# EAGLE schematic ilmat (EAGLE 6.3)
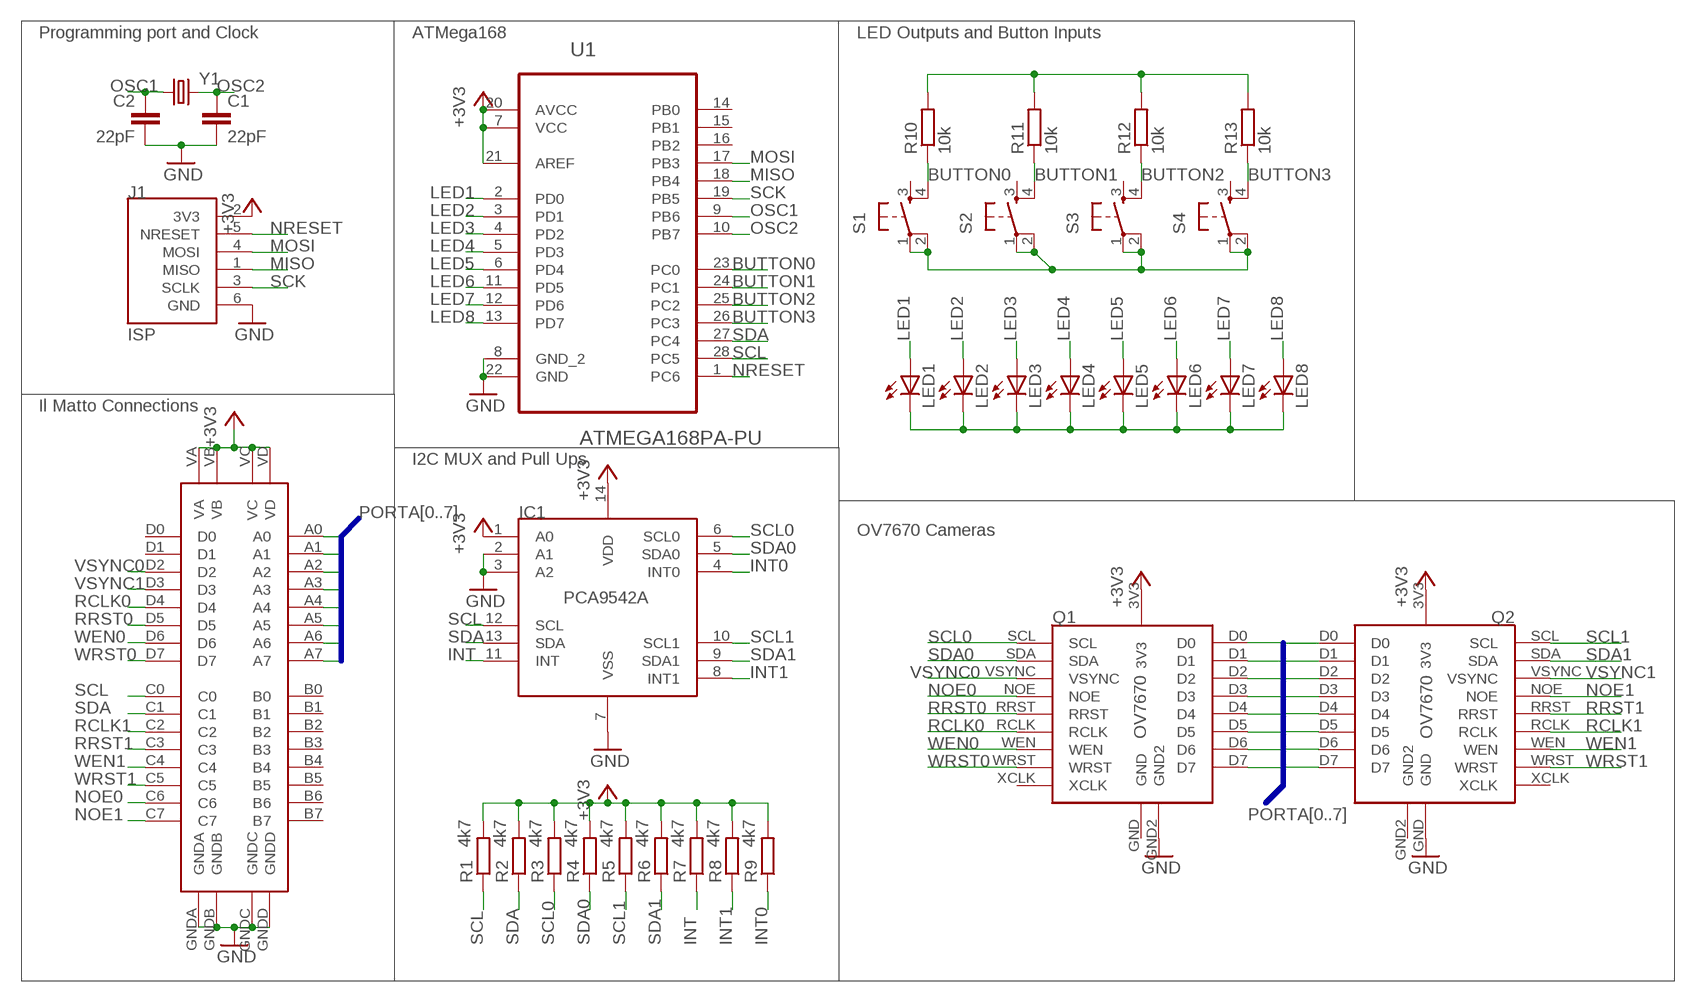
[diagram p0: schematic, sheet 1]

## Parts
C1  22pF  C-EU025-024X044  [C025-024X044]
C2  22pF  C-EU025-024X044  [C025-024X044]
IC1  PCA9542A  [TSSOP14]
J1  ISP  [DUALHEAD_TH_6]
LED1  LED-3MM-NO_SILK  [LED3MM-NS]
LED2  LED-3MM-NO_SILK  [LED3MM-NS]
LED3  LED-3MM-NO_SILK  [LED3MM-NS]
LED4  LED-3MM-NO_SILK  [LED3MM-NS]
LED5  LED-3MM-NO_SILK  [LED3MM-NS]
LED6  LED-3MM-NO_SILK  [LED3MM-NS]
LED7  LED-3MM-NO_SILK  [LED3MM-NS]
LED8  LED-3MM-NO_SILK  [LED3MM-NS]
Q1  OV7670  [OV7670]
Q2  OV7670  [OV7670]
R1  4k7  R12MM  [V234/12]
R2  4k7  R12MM  [V234/12]
R3  4k7  R12MM  [V234/12]
R4  4k7  R12MM  [V234/12]
R5  4k7  R12MM  [V234/12]
R6  4k7  R12MM  [V234/12]
R7  4k7  R12MM  [V234/12]
R8  4k7  R12MM  [V234/12]
R9  4k7  R12MM  [V234/12]
R10  10k  R12MM  [V234/12]
R11  10k  R12MM  [V234/12]
R12  10k  R12MM  [V234/12]
R13  10k  R12MM  [V234/12]
S1  TAC_SWITCHPTH  [TACTILE-PTH]
S2  TAC_SWITCHPTH  [TACTILE-PTH]
S3  TAC_SWITCHPTH  [TACTILE-PTH]
S4  TAC_SWITCHPTH  [TACTILE-PTH]
U1  ATMEGA168PA-PU  [DIP254P762X457-28]
U$1  ILMATTOSHEILD  [ILMATSHEILD]
Y1  CRYSTALHC49US  [HC49US]

## Nets
+3V3: IC1.1(A0) IC1.14(VDD) J1.2(3V3) Q1.3V3 Q2.3V3 R1.2 R2.2 R3.2 R4.2 R5.2 R6.2 R7.2 R8.2 R9.2 U1.7(VCC) U1.20(AVCC) U1.21(AREF) U$1.VA U$1.VB U$1.VC U$1.VD
BUTTON0: R10.1 S1.4 U1.23(PC0)
BUTTON1: R11.1 S2.4 U1.24(PC1)
BUTTON2: R12.1 S3.4 U1.25(PC2)
BUTTON3: R13.1 S4.4 U1.26(PC3)
GND: C1.2 C2.2 IC1.2(A1) IC1.3(A2) IC1.7(VSS) J1.6(GND) Q1.GND2 Q2.GND U1.8(GND_2) U1.22(GND) U$1.GNDA U$1.GNDB U$1.GNDC U$1.GNDD
INT: IC1.11(INT) R7.1
INT0: IC1.4(INT0) R9.1
INT1: IC1.8(INT1) R8.1
LED1: LED1.A U1.2(PD0)
LED2: LED2.A U1.3(PD1)
LED3: LED3.A U1.4(PD2)
LED4: LED4.A U1.5(PD3)
LED5: LED5.A U1.6(PD4)
LED6: LED6.A U1.11(PD5)
LED7: LED7.A U1.12(PD6)
LED8: LED8.A U1.13(PD7)
MISO: J1.1(MISO) U1.18(PB4)
MOSI: J1.4(MOSI) U1.17(PB3)
N$1: LED1.K(C) LED2.K(C) LED3.K(C) LED4.K(C) LED5.K(C) LED6.K(C) LED7.K(C) LED8.K(C)
N$5: S1.1 S1.2 S2.1 S2.2 S3.1 S3.2 S4.1 S4.2
N$6: R10.2 R11.2 R12.2 R13.2
NOE0: Q1.NOE U$1.C6
NOE1: Q2.NOE U$1.C7
NRESET: J1.5(NRESET) U1.1(PC6)
OSC1: C2.1 U1.9(PB6) Y1.1
OSC2: C1.1 U1.10(PB7) Y1.2
PORTA0: Q1.D0 Q2.D0 U$1.A0
PORTA1: Q1.D1 Q2.D1 U$1.A1
PORTA2: Q1.D2 Q2.D2 U$1.A2
PORTA3: Q1.D3 Q2.D3 U$1.A3
PORTA4: Q1.D4 Q2.D4 U$1.A4
PORTA5: Q1.D5 Q2.D5 U$1.A5
PORTA6: Q1.D6 Q2.D6 U$1.A6
PORTA7: Q1.D7 Q2.D7 U$1.A7
RCLK0: Q1.RCLK U$1.D4
RCLK1: Q2.RCLK U$1.C2
RRST0: Q1.RRST U$1.D5
RRST1: Q2.RRST U$1.C3
SCK: J1.3(SCLK) U1.19(PB5)
SCL: IC1.12(SCL) R1.1 U1.28(PC5) U$1.C0
SCL0: IC1.6(SCL0) Q1.SCL R3.1
SCL1: IC1.10(SCL1) Q2.SCL R5.1
SDA: IC1.13(SDA) R2.1 U1.27(PC4) U$1.C1
SDA0: IC1.5(SDA0) Q1.SDA R4.1
SDA1: IC1.9(SDA1) Q2.SDA R6.1
VSYNC0: Q1.VSYNC U$1.D2
VSYNC1: Q2.VSYNC U$1.D3
WEN0: Q1.WEN U$1.D6
WEN1: Q2.WEN U$1.C4
WRST0: Q1.WRST U$1.D7
WRST1: Q2.WRST U$1.C5
Unconnected: Q1.XCLK Q2.XCLK S1.3 S2.3 S3.3 S4.3 U1.14(PB0) U1.15(PB1) U1.16(PB2) U$1.B0 U$1.B1 U$1.B2 U$1.B3 U$1.B4 U$1.B5 U$1.B6 U$1.B7 U$1.D0 U$1.D1

## Buses
PORTA[0..7]

## Notes on the sheet
- Programming port and Clock | ATMega168 | LED Outputs and Button Inputs
- Il Matto Connections
- I2C MUX and Pull Ups
- OV7670 Cameras

## Power pins joined to a net without a drawn wire
GND: Q1.GND
GND2: Q2.GND2

## Library data of the parts
C1 C2 = passives:C-EU: CAPACITOR, European symbol
IC1 = ICs:PCA9542A
J1 = Headers:ISP
LED1-LED8 = SparkFun:LED: LEDs Standard schematic elements and footprints for 5mm, 3mm, 1206, and 0603 sized LEDs. 5mm - Spark Fun Electronics SKU : COM-00529 (and others)
Q1 Q2 = Misc:OV7670
R1-R13 = passives:R
S1-S4 = SparkFun:TAC_SWITCH: Momentary Switch Button commonly used for reset or general input. Spark Fun Electronics SKU : COM-00097
U1 = Atmel_By_element14_Batch_1:ATMEGA168PA-PU: MCU; DESCRIPTION: MCU; MPN: ATMEGA168PA-PU; OC_FARNELL: 1841606; OC_NEWARK: 12T1298; PACKAGE: DIP-28; SUPPLIER: Atmel
U$1 = Headers:ILMATTOSHEILD
Y1 = SparkFun:CRYSTAL: Crystals Various standard crystals. Proven footprints. Spark Fun Electronics SKU : COM-00534